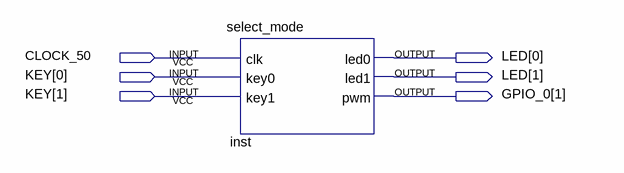
[diagram p0: schematic sheet]
// Quartus schematic test1.bdf as structural Verilog: 1 symbols, 6 pins
module test1 (
  input  CLOCK_50,
  input  [1:0] KEY,
  output [1:0] LED,
  output [1:1] GPIO_0
);

  select_mode inst (.clk(CLOCK_50), .key0(KEY[0]), .key1(KEY[1]), .led0(LED[0]), .led1(LED[1]), .pwm(GPIO_0[1]));
endmodule
